# Altium schematic sheet Cercuit design.SchDoc
size A
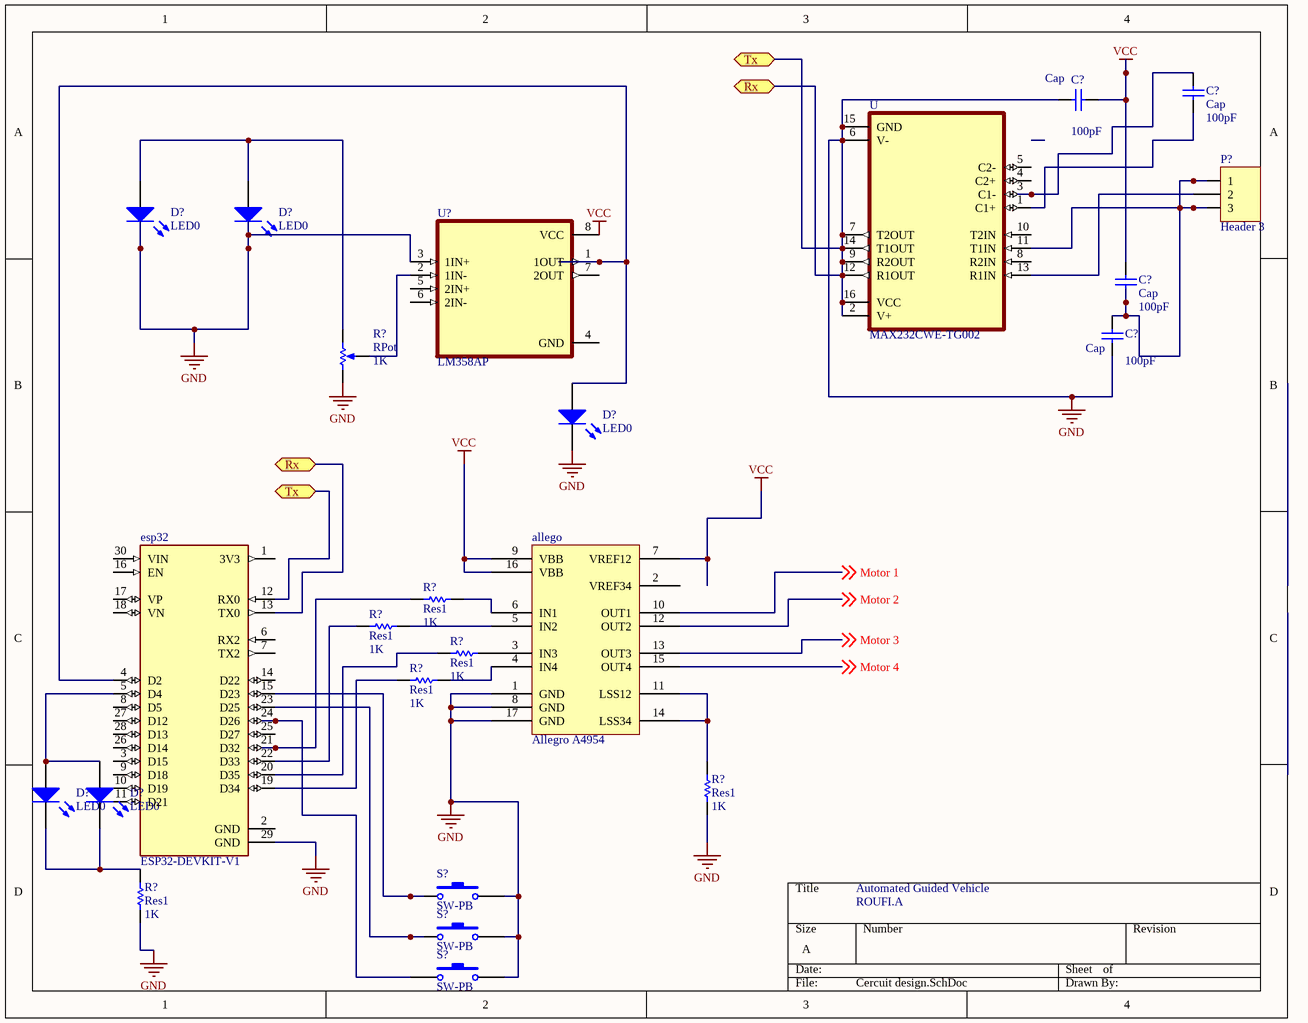
[diagram p0: Cercuit design.SchDoc]

## Parts
(Parts that share a designator on the sheet are numbered #1, #2 ... from top to bottom, then left to right.)
allego  Allegro A4954
C?#1  Cap  value 100pF  [RAD-0.3]
C?#2  Cap  value 100pF  [RAD-0.3]
C?#3  Cap  value 100pF  [RAD-0.3]
C?#4  Cap  value 100pF  [RAD-0.3]
D?#1  LED0  [LED-0]
D?#2  LED0  [LED-0]
D?#3  LED0  [LED-0]
D?#4  LED0  [LED-0]
D?#5  LED0  [LED-0]
esp32  ESP32-DEVKIT-V1  [MODULE_ESP32_DEVKIT_V1]
P?  Header 3  [HDR1X3]
R?#1  RPot  value 1K  [VR5]
R?#2  Res1  value 1K  [AXIAL-0.3]
R?#3  Res1  value 1K  [AXIAL-0.3]
R?#4  Res1  value 1K  [AXIAL-0.3]
R?#5  Res1  value 1K  [AXIAL-0.3]
R?#6  Res1  value 1K  [AXIAL-0.3]
R?#7  Res1  value 1K  [AXIAL-0.3]
S?#1  SW-PB  [SPST-2]
S?#2  SW-PB  [SPST-2]
S?#3  SW-PB  [SPST-2]
U  MAX232CWE-TG002  [SOIC127P1032X265-16N]
U?  LM358AP  [DIP794W45P254L959H508Q8]

## Ports
Rx, Tx

## Nets
GND: allego.1(GND) allego.8(GND) allego.17(GND) C?#1.1 C?#4.1 D?#1.2(K) D?#2.2(K) D?#3.2(K) esp32.12(RX0) esp32.13(TX0) esp32.29(GND) R?#1.1(TOP) R?#6.1 R?#7.1 S?#1.2 S?#2.2 S?#3.2 U.2(V+) U.6(V-) U.7(T2OUT) U.9(R2OUT) U.12(R1OUT) U.14(T1OUT) U.15(GND) U.16(VCC) U?.3(1IN+) ; port Tx, port Rx
VCC: allego.7(VREF12) allego.9(VBB) allego.16(VBB) C?#1.2 C?#3.2 U?.8(VCC)
Motor 1: allego.10(OUT1) ; off-sheet Motor 1
Motor 2: allego.12(OUT2) ; off-sheet Motor 2
Motor 3: allego.13(OUT3) ; off-sheet Motor 3
Motor 4: allego.15(OUT4) ; off-sheet Motor 4
Netallego_3: allego.3(IN3) R?#4.2
Netallego_4: allego.4(IN4) R?#5.2
Netallego_5: allego.5(IN2) R?#3.2
Netallego_6: allego.6(IN1) R?#2.2
Netallego_11: allego.11(LSS12) allego.14(LSS34) R?#6.2
NetC?#2_1: C?#2.1 U.1(C1+)
NetC?#2_2: C?#2.2 U.3(C1-)
NetC?#3_1: C?#3.1 C?#4.2 P?.1 P?.3 U.11(T1IN)
NetD?#1_1: D?#1.1(A) D?#2.1(A) R?#1.2(BOT)
NetD?#3_1: D?#3.1(A) esp32.4(D2) U?.1(1OUT)
NetD?#4_1: D?#4.1(A) D?#5.1(A) esp32.5(D4)
NetD?#4_2: D?#4.2(K) D?#5.2(K) R?#7.2
Netesp32_15: esp32.15(D23) S?#1.1
Netesp32_19: esp32.19(D34) R?#5.1
Netesp32_20: esp32.20(D35) R?#4.1
Netesp32_21: esp32.21(D32) R?#2.1
Netesp32_22: esp32.22(D33) R?#3.1
Netesp32_23: esp32.23(D25) S?#2.1
Netesp32_24: esp32.24(D26) S?#3.1
NetP?_2: P?.2 U.13(R1IN)
NetR?#1_3: R?#1.3(TAP) U?.2(1IN-)

Not connected (* = marked no-connect by the designer): allego 2(VREF34); esp32 1(3V3) 2(GND) 3(D15) 6(RX2) 7(TX2) 8(D5) 9(D18) 10(D19) 11(D21) 14(D22) 16(EN) 17(VP) 18(VN) 25(D27) 26(D14) 27(D12) 28(D13) 30(VIN); U 4(C2+) 5(C2-) 8(R2IN) 10(T2IN); U? 4(GND) 5(2IN+) 6(2IN-) 7(2OUT)

## Notes on the sheet
- Automated Guided Vehicle
- ROUFI.A

## Library data of the parts
C?#1-C?#4 = Cap: Capacitor; Published: 8-Jun-2000; LatestRevisionDate: 17-Jul-2002; LatestRevisionNote: Re-released for DXP Platform.; PackageReference: RAD-0.3; Publisher: Altium Limited; PackageDescription: Radial Cap, Thru-Hole; 2 Leads; 0.3 in Pin Spacing
D?#1-D?#5 = LED0: Typical INFRARED GaAs LED; Published: 8-Jun-2000; LatestRevisionDate: 08-Jul-2005; LatestRevisionNote: Mech Layer 1 removed.; PackageReference: LED-0; Publisher: Altium Limited; PackageDescription: LED; 2 Leads
esp32 = ESP32-DEVKIT-V1: Dual core, Wi-Fi: 2.4 GHz up to 150 Mbits/s,BLE (Bluetooth Low Energy) and legacy Bluetooth, 32 bits, Up to 240 MHz; MF: Do it; Price: None; Availability: Not in stock; Package: None; MP: ESP32-DEVKIT-V1; Value: *; SnapEDA_Link: https://www.snapeda.com/parts/ESP32-DEVKIT-V1/Do+it/view-part/?ref=snap; Check_prices: https://www.snapeda.com/parts/ESP32-DEVKIT-V1/Do+it/view-part/?ref=eda
P? = Header 3: Header, 3-Pin; LatestRevisionDate: 17-Jul-2002; LatestRevisionNote: Re-released for DXP Platform.; Publisher: Altium Limited
R?#1 = RPot: Potentiometer; Sim Note: Enter the Resistance value and the set point into parameter fields.; Set Position: 0.5; Published: 8-Jun-2000; LatestRevisionDate: 17-Jul-2002; LatestRevisionNote: Re-released for DXP Platform.; PackageReference: VR5; Publisher: Altium Limited; PackageDescription: Variable Resistor, Thru-Hole; 3 Leads
R?#2-R?#7 = Res1: Resistor; Published: 8-Jun-2000; LatestRevisionDate: 17-Jul-2002; LatestRevisionNote: Re-released for DXP Platform.; PackageReference: AXIAL-0.3; Publisher: Altium Limited; PackageDescription: Axial Device, Thru-Hole; 2 Leads; 0.3 in Pin Spacing
S?#1-S?#3 = SW-PB: Switch; Published: 24-Mar-1999; LatestRevisionDate: 17-Jul-2002; LatestRevisionNote: Re-released for DXP Platform.; PackageReference: SPST-2; Publisher: Altium Limited; PackageDescription: Switch; 2 Leads
U = MAX232CWE-TG002: 2/2 Transceiver Full RS232 16-SOIC; MF: Maxim Integrated; Price: None; SnapEDA_Link: https://www.snapeda.com/parts/MAX232CWE/Maxim%20Integrated/view-part/977003/?ref=snap; MP: MAX232CWE; Value: *; Availability: Unavailable; Package: SOIC-16 Maxim Integrated
U? = LM358AP: Package: None; Availability: Unavailable; MP: LM358AP; Value: *; Price: None